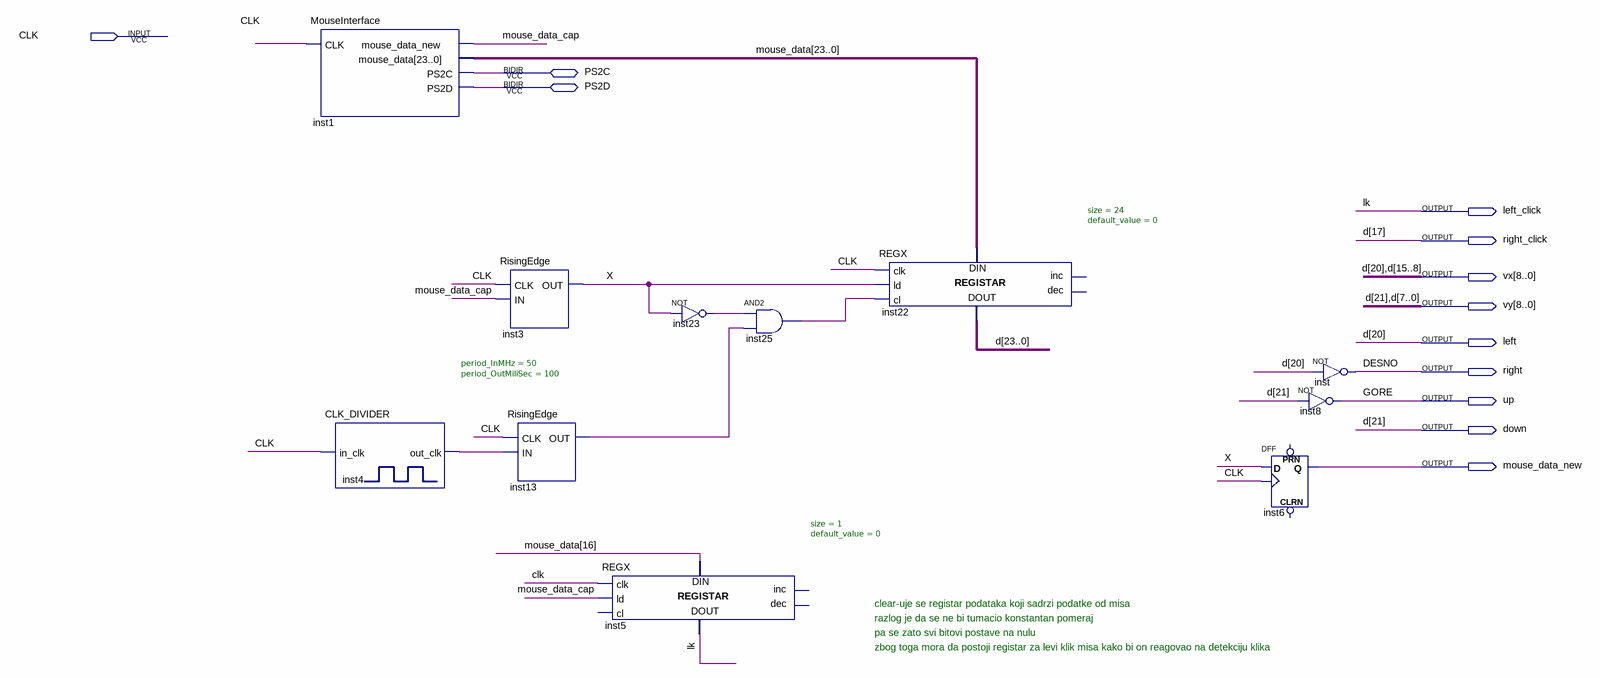
[diagram p0: schematic sheet]
// Quartus schematic MouseController.bdf as structural Verilog: 11 symbols, 12 pins
module MouseController (
  input  CLK,
  inout  PS2C,
  inout  PS2D,
  output left_click,
  output right_click,
  output [8:0] vx,
  output [8:0] vy,
  output left,
  output right,
  output up,
  output down,
  output mouse_data_new
);

  wire inst4_out_clk, inst13_out, inst23_out, inst25_out, mouse_data_cap, X;
  wire [23:0] mouse_data;
  wire [23:16] d;

  MouseInterface inst1 (.CLK(CLK), .mouse_data_new(mouse_data_cap), .mouse_data(mouse_data), .PS2C(PS2C), .PS2D(PS2D));
  CLK_DIVIDER #(.period_InMHz(50), .period_OutMiliSec(100)) inst4 (.in_clk(CLK), .out_clk(inst4_out_clk));
  RisingEdge inst3 (.CLK(CLK), .IN(mouse_data_cap), .OUT(X));
  RisingEdge inst13 (.CLK(CLK), .IN(inst4_out_clk), .OUT(inst13_out));
  REGX #(.size(1), .default_value(0)) inst5 (
    .clk(CLK), .ld(mouse_data_cap), .data_in(mouse_data[16]), .data_out(left_click));  // open: cl, inc, dec
  not inst23 (inst23_out, X);
  and inst25 (inst25_out, inst23_out, inst13_out);
  REGX #(.size(24), .default_value(0)) inst22 (
    .clk(CLK), .ld(X), .cl(inst25_out), .data_in(mouse_data),
    .data_out({d[23:22], down, left, d[19:18], right_click, d[16], vx[7:0], vy[7:0]}));  // open: inc, dec
  DFF inst6 (.CLK(CLK), .D(X), .Q(mouse_data_new));  // open: CLRN, PRN
  not inst (right, left);
  not inst8 (up, down);

  assign vx[8] = left;
  assign vy[8] = down;

  // Other names for the same wires on the sheet: d (some bits) = {down, left, right_click, vx[7:0], vy[7:0]};
  //   DESNO = right; GORE = up; lk = left_click

  // Notes on the sheet:
  //   clear-uje se registar podataka koji sadrzi podatke od misa
  //   razlog je da se ne bi tumacio konstantan pomeraj
  //   pa se zato svi bitovi postave na nulu
  //   zbog toga mora da postoji registar za levi klik misa kako bi on reagovao na detekciju klika
endmodule
